# EAGLE design arduino-pro-mini_2-way-switches_v0.2.2 (EAGLE 7.2.0)
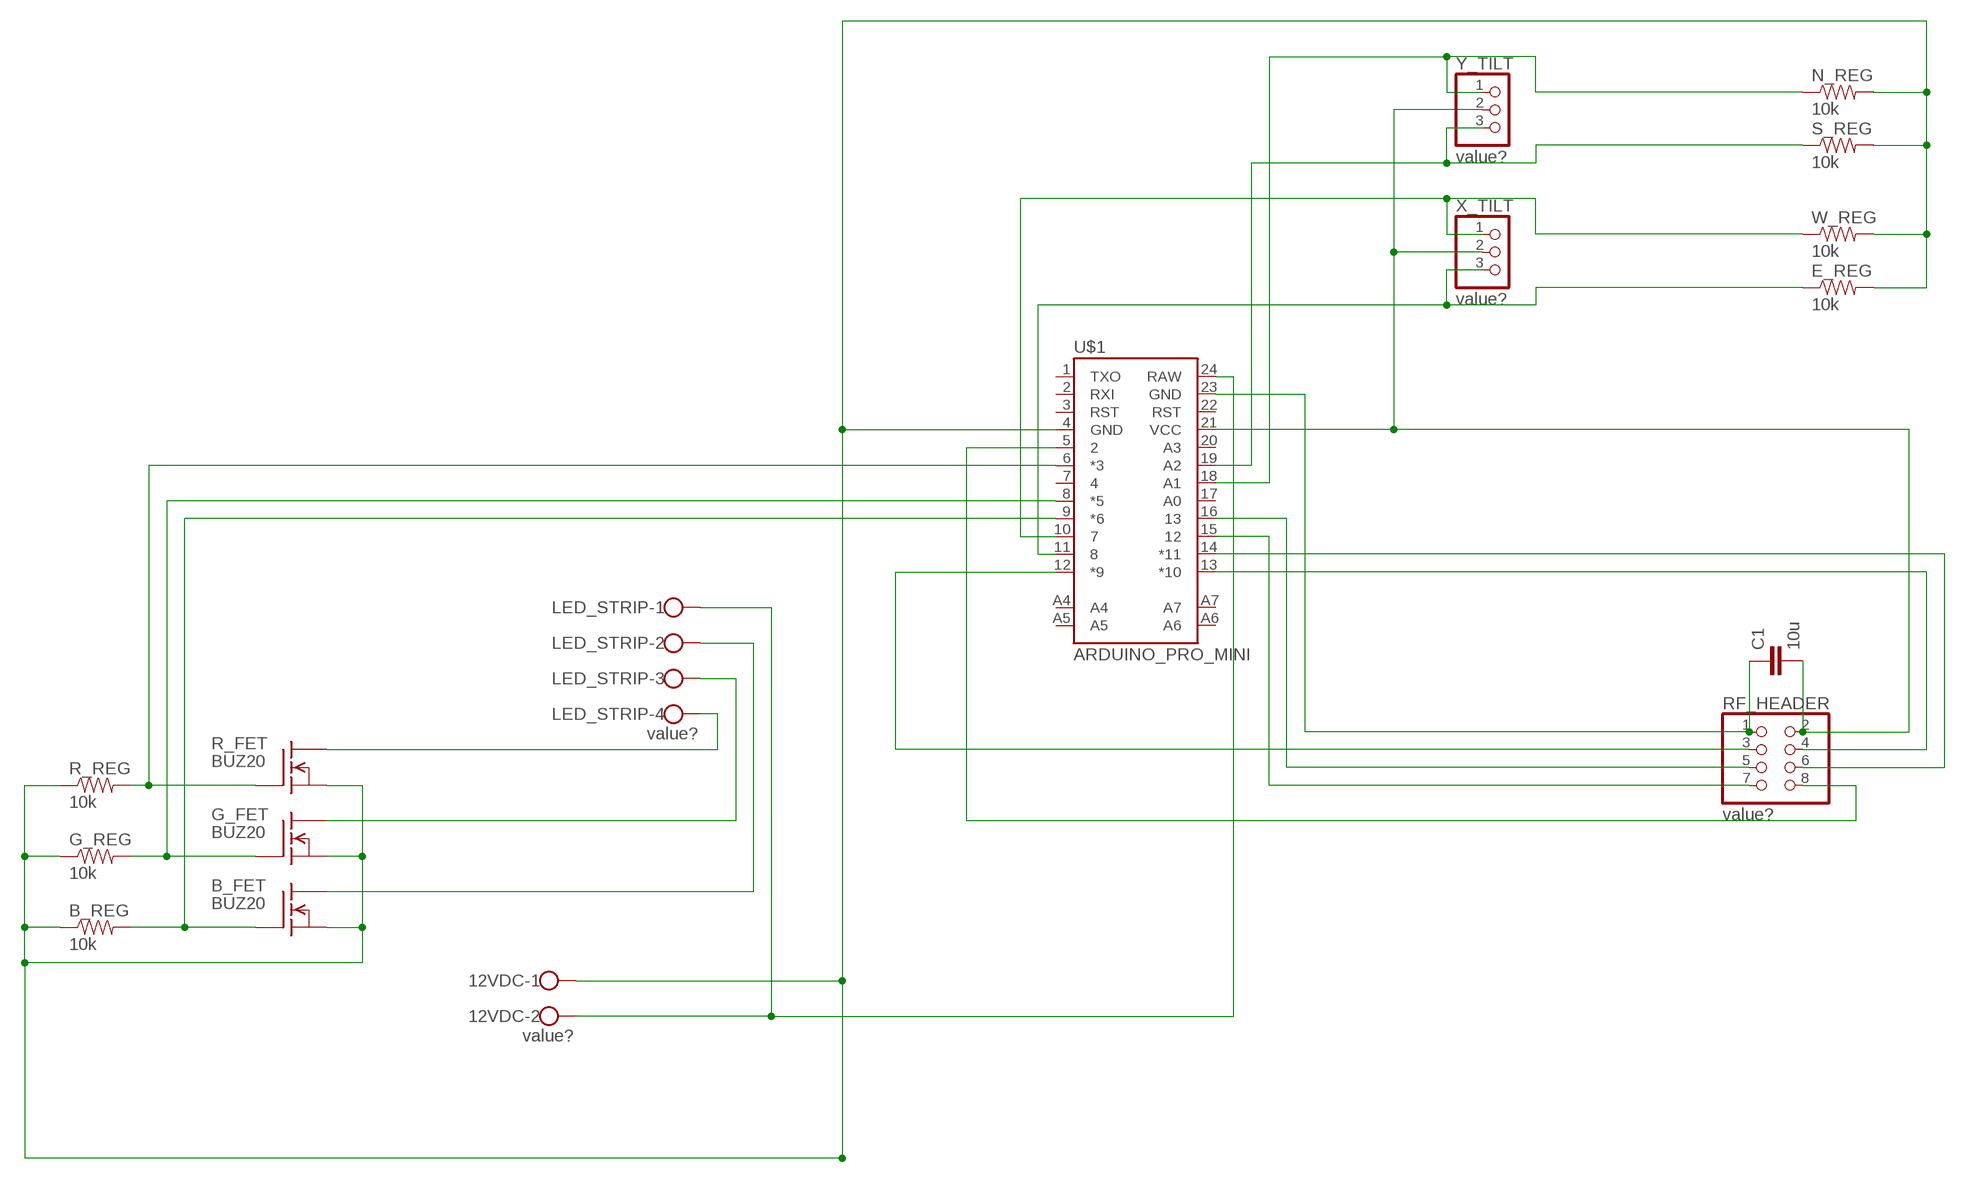
[diagram p0: schematic, sheet 1]

## Parts
12VDC  value?  W237-102  [W237-102]
B_FET  BUZ20  [TO220]
B_REG  10k  RESISTORPTH-1/4W  [AXIAL-0.4]
C1  10u  CAPPTH  [CAP-PTH-SMALL]
E_REG  10k  RESISTORPTH-1/4W  [AXIAL-0.4]
G_FET  BUZ20  [TO220]
G_REG  10k  RESISTORPTH-1/4W  [AXIAL-0.4]
LED_STRIP  value?  W237-4  [W237-4]
N_REG  10k  RESISTORPTH-1/4W  [AXIAL-0.4]
R_FET  BUZ20  [TO220]
R_REG  10k  RESISTORPTH-1/4W  [AXIAL-0.4]
RF_HEADER  value?  PINHD-2X4  [2X04]
S_REG  10k  RESISTORPTH-1/4W  [AXIAL-0.4]
U$1  ARDUINO_PRO_MINI  [ARDUINO_PRO_MINI]
W_REG  10k  RESISTORPTH-1/4W  [AXIAL-0.4]
X_TILT  value?  PINHD-1X3  [1X03]
Y_TILT  value?  PINHD-1X3  [1X03]

## Nets
N$1: U$1.10 W_REG.P$1 X_TILT.1
N$2: B_FET.1(G) B_REG.P$2 U$1.9(*6)
N$3: R_FET.1(G) R_REG.P$2 U$1.6(*3)
N$4: G_FET.2(D) LED_STRIP.3
N$5: B_FET.2(D) LED_STRIP.2
N$6: E_REG.P$1 U$1.11 X_TILT.3
N$7: LED_STRIP.4 R_FET.2(D)
N$9: 12VDC.2 LED_STRIP.1 U$1.24(RAW)
N$10: 12VDC.1 B_FET.3(S) B_REG.P$1 E_REG.P$2 G_FET.3(S) G_REG.P$1 N_REG.P$2 R_FET.3(S) R_REG.P$1 S_REG.P$2 U$1.4(GND) W_REG.P$2
N$13: G_FET.1(G) G_REG.P$2 U$1.8(*5)
N$14: S_REG.P$1 U$1.19(A2) Y_TILT.3
N$15: RF_HEADER.3 U$1.12(*9)
N$16: RF_HEADER.4 U$1.13(*10)
N$17: RF_HEADER.6 U$1.14(*11)
N$18: C1.1 RF_HEADER.1 U$1.23(GND)
N$21: RF_HEADER.7 U$1.15
N$23: RF_HEADER.5 U$1.16
N$25: RF_HEADER.8 U$1.5
N$27: N_REG.P$1 U$1.18(A1) Y_TILT.1
Y_TILT: C1.2 RF_HEADER.2 U$1.21(VCC) X_TILT.2 Y_TILT.2
Unconnected: U$1.1(TXO) U$1.2(RXI) U$1.3(RST) U$1.7 U$1.17(A0) U$1.20(A3) U$1.22(RST) U$1.A4 U$1.A5 U$1.A6 U$1.A7

## Library data of the parts
12VDC = con-wago-500:W237-102: WAGO SCREW CLAMP; MPN: 237-102; OC_FARNELL: unknown; OC_NEWARK: 70K9898
B_FET G_FET R_FET = transistor-fet:BUZ20: N-Channel Enhancement MOSFET 100V; 12A; 0,2Ohm
B_REG E_REG G_REG N_REG R_REG S_REG W_REG = SparkFun-Passives:RESISTOR: Resistor Basic schematic elements and footprints for 0603, 1206, and PTH resistors.
C1 = SparkFun-Passives:CAP: Capacitor Standard 0603 ceramic capacitor, and 0.1" leaded capacitor.
LED_STRIP = con-wago-500:W237-4: WAGO SCREW CLAMP; OC_FARNELL: unknown; OC_NEWARK: unknown
RF_HEADER = rf-header:PINHD-2X4: PIN HEADER
U$1 = SparkFun-Boards:ARDUINO_PRO_MINI
X_TILT Y_TILT = pinhead:PINHD-1X3: PIN HEADER

## Board
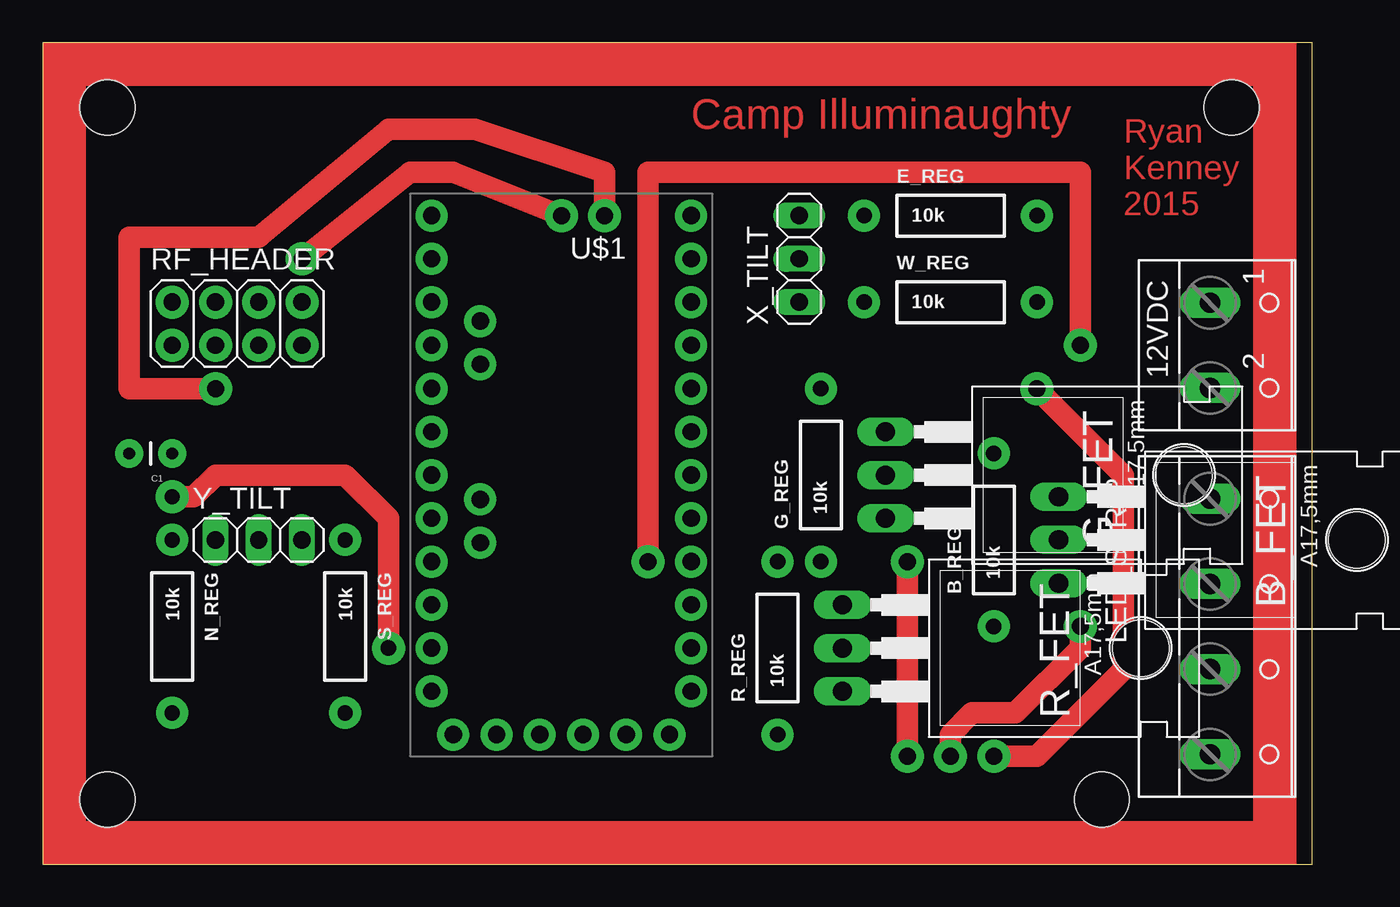
[diagram p1: board, top side]
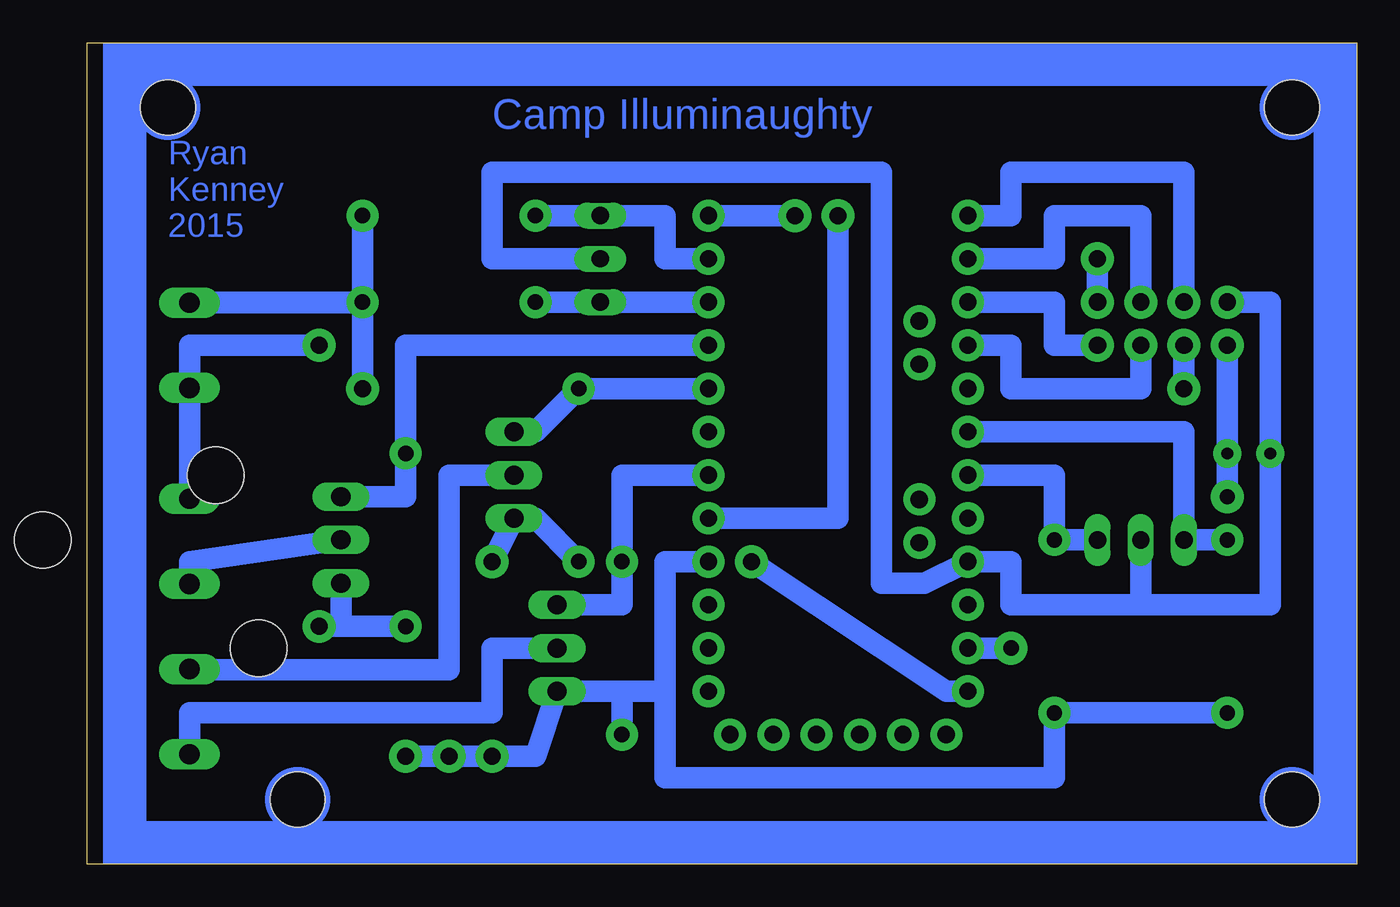
[diagram p2: board, bottom side, seen from below]

Size 74.6 x 48.25 mm. Coordinates in mm from the lower left corner, seen from the top.
Outline: 0,0 74.6,0 74.6,48.25 0,48.25 0,0
Copper layers (1*16): Top 0.035mm / dielectric 1.5mm / Bottom 0.035mm
Design rules "default": minimum track width 10mil, minimum drill 24mil, track to track 8mil, track to pad 8mil, pad to pad 8mil, via to via 8mil, smd to smd 8mil, copper to edge 40mil, drill to drill 8mil, minimum pad ring 10mil, minimum via ring 8mil, stop-mask expansion 4mil, vias tented up to drill 0mil, thermal gap 10mil
Holes 3.2 mm at 3.81,44.45 3.81,3.81 69.85,44.45 62.23,3.81

### Footprints (pad centres in the part's own frame; a part is rotated, then mirrored left to right if it is on the bottom)
W237-102 = drill 1.194 long: 1 -2.5,-1.27; 2 2.5,-1.27
TO220 = drill 1.118 long: 1 -2.54,-6.35; 2 0,-6.35; 3 2.54,-6.35 | hole 3.302: 0,11.176
AXIAL-0.4 = drill 0.9 pad 1.88: P$1 -5.08,0; P$2 5.08,0
CAP-PTH-SMALL = drill 0.7 pad 1.651: 1 0,0; 2 2.54,0
W237-4 = drill 1.194 long: 1 -7.5,-1.27; 2 -2.5,-1.27; 3 2.5,-1.27; 4 7.5,-1.27
2X04 = drill 1.016 pad 1.93: 1 -3.81,-1.27; 2 -3.81,1.27; 3 -1.27,-1.27; 4 -1.27,1.27; 5 1.27,-1.27; 6 1.27,1.27; 7 3.81,-1.27; 8 3.81,1.27
ARDUINO_PRO_MINI = drill 1.016 pad 1.88: 1 -7.62,12.7; 2 -7.62,10.16; 3 -7.62,7.62; 4 -7.62,5.08; 5 -7.62,2.54; 6 -7.62,0; 7 -7.62,-2.54; 8 -7.62,-5.08; 9 -7.62,-7.62; 10 -7.62,-10.16; 11 -7.62,-12.7; 12 -7.62,-15.24; 13 7.62,-15.24; 14 7.62,-12.7; 15 7.62,-10.16; 16 7.62,-7.62; 17 7.62,-5.08; 18 7.62,-2.54; 19 7.62,0; 20 7.62,2.54; 21 7.62,5.08; 22 7.62,7.62; 23 7.62,10.16; 24 7.62,12.7; A4 4.763,1.429; A5 4.763,3.969; A6 4.763,-9.049; A7 4.763,-6.509; BLK -6.35,15.24; GND -3.81,15.24; GRN 6.35,15.24; RXI 1.27,15.24; TXO 3.81,15.24; VCC -1.27,15.24
1X03 = drill 1.016 long: 1 -2.54,0; 2 0,0; 3 2.54,0

### Placement (x,y rotation side)
12VDC  69.85,30.48 270 top
B_FET  66.04,19.05 270 top
B_REG  55.88,19.05 90 top
C1  7.62,24.13 180 top
E_REG  53.34,38.1 0 top
G_FET  55.88,22.86 270 top
G_REG  45.72,22.86 90 top
LED_STRIP  69.85,13.97 270 top
N_REG  7.62,13.97 270 top
R_FET  53.34,12.7 270 top
R_REG  43.18,12.7 90 top
RF_HEADER  11.43,31.75 0 top
S_REG  17.78,13.97 270 top
U$1  30.48,22.86 180 top
W_REG  53.34,33.02 0 top
X_TILT  44.45,35.56 90 top
Y_TILT  12.7,19.05 0 top

### Tracks (layer width: path | path; a pad name or v marks a point on that pad's centre or on a via)
N$1
  Bottom 1.27: U$1.10 X_TILT.1 W_REG.P$1
N$2
  Bottom 1.27: U$1.9 55.88,30.48 B_REG.P$2 55.88,21.59 B_FET.1
N$3
  Bottom 1.27: U$1.6 43.18,22.86 R_REG.P$2 43.18,15.24 R_FET.1
N$4
  Bottom 1.27: G_FET.2 53.34,22.86 53.34,11.43 68.58,11.43 LED_STRIP.3
N$5
  Bottom 1.27: B_FET.2 68.58,17.78 LED_STRIP.2
N$6
  Bottom 1.27: E_REG.P$1 X_TILT.3 40.64,38.1 40.64,35.56 U$1.11
N$7
  Bottom 1.27: R_FET.2 50.8,12.7 50.8,8.89 68.58,8.89 LED_STRIP.4
N$9  (via drill 1 pad 1.93)
  Top 1.27: v35.56,17.78 35.56,40.64 60.96,40.64 v60.96,30.48
  Bottom 1.27: LED_STRIP.1 12VDC.2 68.58,30.48 v60.96,30.48 | U$1.24 24.13,10.16 v35.56,17.78
N$10  (via drill 1 pad 1.93)
  Top 1.27: v50.8,17.78 v50.8,6.35 | v58.42,27.94 63.5,22.86 63.5,11.43 58.42,6.35 v55.88,6.35 | v60.96,13.97 60.96,12.7 57.15,8.89 54.61,8.89 53.34,7.62 v53.34,6.35
  Bottom 1.27: N_REG.P$2 S_REG.P$2 17.78,5.08 40.64,5.08 40.64,10.16 | 40.64,10.16 40.64,17.78 U$1.4 | 40.64,10.16 43.18,10.16 | 43.18,10.16 R_FET.3 48.26,6.35 v50.8,6.35 v53.34,6.35 v55.88,6.35 | R_REG.P$1 43.18,10.16 | G_REG.P$1 48.26,20.32 G_FET.3 v50.8,17.78 | B_REG.P$1 59.69,13.97 | 59.69,13.97 v60.96,13.97 | E_REG.P$2 W_REG.P$2 62.23,33.02 | 62.23,33.02 64.77,33.02 | 64.77,33.02 68.58,33.02 12VDC.1 64.77,32.98 | 64.77,32.98 64.77,33.02 | 64.77,32.98 58.42,32.98 | 58.42,32.98 62.23,33.02 | 58.42,32.98 v58.42,27.94 | B_FET.3 59.69,13.97
N$13
  Bottom 1.27: U$1.8 G_REG.P$2 48.26,25.4 G_FET.1
N$14
  Bottom 1.27: U$1.19 17.78,22.86 S_REG.P$1 Y_TILT.3
N$15  (via drill 1 pad 1.93)
  Top 1.27: v10.16,27.94 5.08,27.94 5.08,36.83 12.7,36.83 20.32,43.18 25.4,43.18 33.02,40.64 v33.02,38.1
  Bottom 1.27: v33.02,38.1 U$1.12 | RF_HEADER.3 v10.16,27.94
N$16
  Bottom 1.27: U$1.13 20.32,38.1 20.32,40.64 10.16,40.64 RF_HEADER.4
N$17
  Bottom 1.27: U$1.14 17.78,35.56 17.78,38.1 12.7,38.1 RF_HEADER.6
N$18  (via drill 0.9 pad 1.93)
  Top 1.27: v20.32,12.7 20.32,20.32 17.78,22.86 10.16,22.86 8.89,21.59 v7.62,21.59
  Bottom 1.27: v7.62,21.59 C1.1 RF_HEADER.1 | v20.32,12.7 U$1.23
N$21
  Bottom 1.27: U$1.15 17.78,33.02 17.78,30.48 RF_HEADER.7
N$23
  Bottom 1.27: U$1.16 20.32,30.48 20.32,27.94 12.7,27.94 RF_HEADER.5
N$25  (via drill 1 pad 1.93)
  Top 1.27: v15.24,35.56 21.59,40.64 24.13,40.64 v30.48,38.1
  Bottom 1.27: v30.48,38.1 30.48,20.32 U$1.5 | RF_HEADER.8 v15.24,35.56
N$27
  Bottom 1.27: N_REG.P$1 Y_TILT.1 10.16,25.4 U$1.18
Y_TILT
  Bottom 1.27: 12.7,15.24 Y_TILT.2 | 12.7,15.24 5.08,15.24 C1.2 5.08,33.02 RF_HEADER.2 | X_TILT.2 50.8,35.56 50.8,40.64 27.94,40.64 27.94,16.51 25.4,16.51 U$1.21 20.32,17.78 20.32,15.24 12.7,15.24
(copper drawn outside any net)
  shapes: Bottom area x6, Bottom circle x4, Top area x4

### Text on the board
Top: Camp Illuminaughty | Ryan / Kenney / 2015
Bottom: Camp Illuminaughty | Ryan / Kenney / 2015